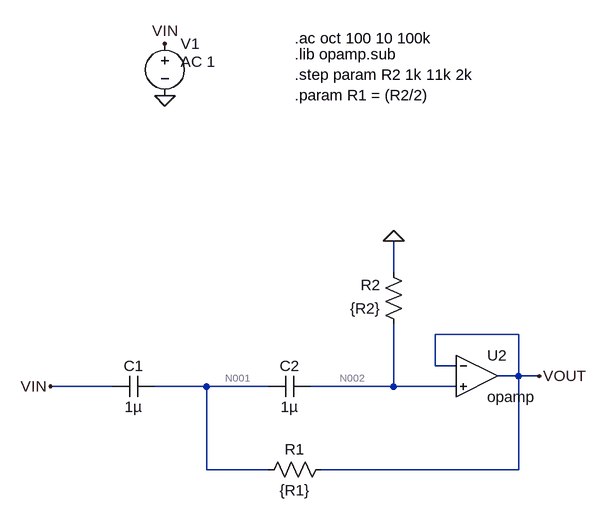
[diagram p0: schematic hpf_math.asc]
hpf_math.asc, the LTspice schematic file:
Version 4.1
SHEET 1 1264 680
WIRE 960 -608 960 -656
WIRE 1152 -512 1024 -512
WIRE 1024 -464 1024 -512
WIRE 1056 -464 1024 -464
WIRE 1152 -448 1152 -512
WIRE 1152 -448 1120 -448
WIRE 1184 -448 1152 -448
WIRE 528 -432 432 -432
WIRE 672 -432 592 -432
WIRE 768 -432 672 -432
WIRE 960 -432 960 -528
WIRE 960 -432 832 -432
WIRE 1056 -432 960 -432
WIRE 672 -304 672 -432
WIRE 768 -304 672 -304
WIRE 1152 -304 1152 -448
WIRE 1152 -304 848 -304
FLAG 1184 -448 VOUT
FLAG 432 -432 VIN
FLAG 960 -656 0
FLAG 608 -960 VIN
FLAG 608 -880 0
SYMBOL OpAmps\\opamp 1088 -512 R0
SYMATTR InstName U2
SYMBOL cap 832 -448 R90
WINDOW 0 0 32 VBottom 2
WINDOW 3 32 32 VTop 2
SYMATTR InstName C2
SYMATTR Value 1µ
SYMBOL cap 592 -448 R90
WINDOW 0 0 32 VBottom 2
WINDOW 3 32 32 VTop 2
SYMATTR InstName C1
SYMATTR Value 1µ
SYMBOL res 864 -320 R90
WINDOW 0 0 56 VBottom 2
WINDOW 3 32 56 VTop 2
SYMATTR InstName R1
SYMATTR Value {R1}
SYMBOL res 976 -512 R180
WINDOW 0 36 76 Left 2
WINDOW 3 36 40 Left 2
SYMATTR InstName R2
SYMATTR Value {R2}
SYMBOL voltage 608 -976 R0
WINDOW 123 24 44 Left 2
WINDOW 39 0 0 Left 0
SYMATTR Value2 AC 1
SYMATTR InstName V1
SYMATTR Value ""
TEXT 808 -968 Left 2 !.ac oct 100 10 100k
TEXT 808 -944 Left 2 !.lib opamp.sub
TEXT 808 -912 Left 2 !.step param R2 1k 11k 2k\n.param R1 = (R2/2)

The netlist it stands for:
* hpf_math.asc
X§U2 VOUT N002 VOUT opamp Aol=100K GBW=10Meg  ; pins invin noninvin out
C2 N002 N001 1µ
C1 N001 VIN 1µ
R1 VOUT N001 {R1}
R2 N002 0 {R2}
V1 VIN 0 AC 1
.ac oct 100 10 100k
.lib opamp.sub
.step param R2 1k 11k 2k
.param R1 = (R2/2)
.backanno
.end

* Results of the author's LTspice run, read from the files saved beside the schematic
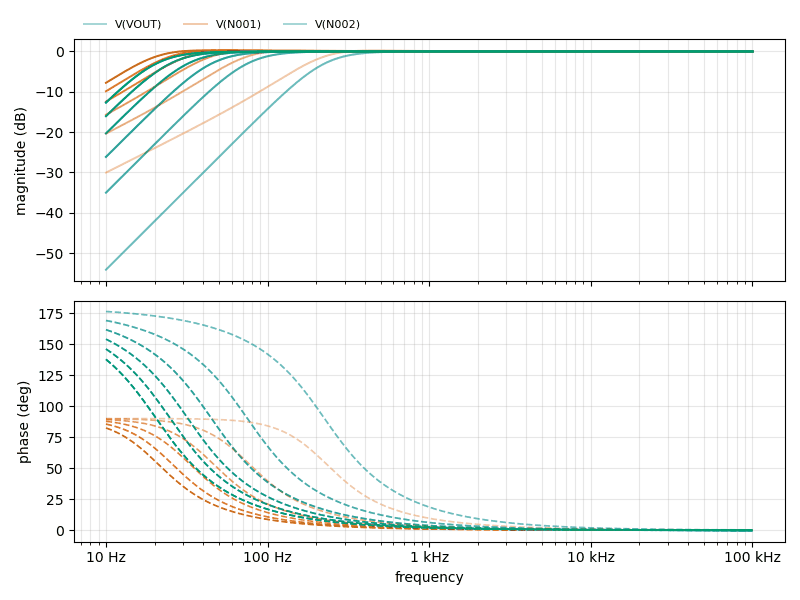
[diagram p1: AC Analysis of hpf_math.asc, plotted from the saved traces]
* AC Analysis, 6 runs:
*   V(VOUT) [r2=1000]: -54.09 dB at 10 Hz, -0.00 dB at 100 kHz, peak -0.00 dB at 8.914 kHz, 3 dB below the peak at 225.1 Hz
*   V(VOUT) [r2=3000]: -35.01 dB at 10 Hz, -0.00 dB at 100 kHz, peak -0.00 dB at 4.335 kHz, 3 dB below the peak at 75.03 Hz
*   V(VOUT) [r2=5000]: -26.15 dB at 10 Hz, -0.00 dB at 100 kHz, peak -0.00 dB at 3.087 kHz, 3 dB below the peak at 45.02 Hz
*   V(VOUT) [r2=7000]: -20.33 dB at 10 Hz, -0.00 dB at 100 kHz, peak -0.00 dB at 2.49 kHz, 3 dB below the peak at 32.15 Hz
*   V(VOUT) [r2=9000]: -16.03 dB at 10 Hz, -0.00 dB at 100 kHz, peak -0.00 dB at 2.108 kHz, 3 dB below the peak at 25.01 Hz
*   V(VOUT) [r2=11000]: -12.68 dB at 10 Hz, -0.00 dB at 100 kHz, peak -0.00 dB at 1.848 kHz, 3 dB below the peak at 20.46 Hz
*   V(N001) [r2=1000]: -30.04 dB at 10 Hz, -0.00 dB at 100 kHz, peak 0.25 dB at 462.1 Hz, 3 dB below the peak at 182.2 Hz
*   V(N001) [r2=3000]: -20.36 dB at 10 Hz, -0.00 dB at 100 kHz, peak 0.25 dB at 154.5 Hz, 3 dB below the peak at 60.73 Hz
*   V(N001) [r2=5000]: -15.68 dB at 10 Hz, -0.00 dB at 100 kHz, peak 0.25 dB at 92.54 Hz, 3 dB below the peak at 36.44 Hz
*   V(N001) [r2=7000]: -12.43 dB at 10 Hz, -0.00 dB at 100 kHz, peak 0.25 dB at 66.35 Hz, 3 dB below the peak at 26.03 Hz
*   V(N001) [r2=9000]: -9.88 dB at 10 Hz, -0.00 dB at 100 kHz, peak 0.25 dB at 51.34 Hz, 3 dB below the peak at 20.24 Hz
*   V(N001) [r2=11000]: -7.77 dB at 10 Hz, -0.00 dB at 100 kHz, peak 0.25 dB at 41.99 Hz, 3 dB below the peak at 16.56 Hz
*   V(N002) [r2=1000]: -54.09 dB at 10 Hz, -0.00 dB at 100 kHz, peak -0.00 dB at 100 kHz, 3 dB below the peak at 225.1 Hz
*   V(N002) [r2=3000]: -35.01 dB at 10 Hz, -0.00 dB at 100 kHz, peak -0.00 dB at 100 kHz, 3 dB below the peak at 75.03 Hz
*   V(N002) [r2=5000]: -26.15 dB at 10 Hz, -0.00 dB at 100 kHz, peak -0.00 dB at 100 kHz, 3 dB below the peak at 45.02 Hz
*   V(N002) [r2=7000]: -20.33 dB at 10 Hz, -0.00 dB at 100 kHz, peak -0.00 dB at 100 kHz, 3 dB below the peak at 32.15 Hz
*   V(N002) [r2=9000]: -16.03 dB at 10 Hz, -0.00 dB at 100 kHz, peak -0.00 dB at 100 kHz, 3 dB below the peak at 25.01 Hz
*   V(N002) [r2=11000]: -12.68 dB at 10 Hz, -0.00 dB at 100 kHz, peak -0.00 dB at 100 kHz, 3 dB below the peak at 20.46 Hz